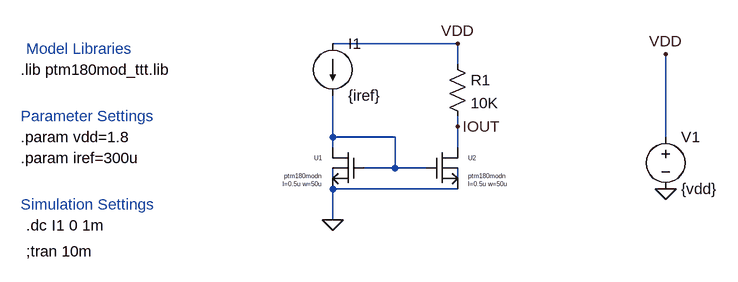
[diagram p0: schematic current_mirror.asc]
current_mirror.asc, the LTspice schematic file:
Version 4
SHEET 1 880 736
WIRE 0 400 -192 400
WIRE 0 432 0 400
WIRE 0 528 0 512
WIRE -192 544 -192 480
WIRE -96 544 -192 544
WIRE 320 544 320 416
WIRE -192 560 -192 544
WIRE 0 560 0 528
WIRE -96 592 -96 544
WIRE -96 592 -144 592
WIRE -48 592 -96 592
WIRE -192 608 -192 592
WIRE 0 608 0 592
WIRE 0 624 -192 624
WIRE -192 672 -192 624
FLAG -192 672 0
FLAG 0 400 VDD
FLAG 320 416 VDD
FLAG 320 624 0
FLAG 0 528 IOUT
SYMBOL voltage 320 528 R0
SYMATTR InstName V1
SYMATTR Value {vdd}
SYMBOL current -192 400 R0
SYMATTR InstName I1
SYMATTR Value {iref}
SYMBOL cnm25mod_nmos4 -144 560 M0
SYMATTR SpiceModel ptm180modn
SYMATTR InstName U1
SYMATTR Value l=0.5u w=50u
SYMBOL cnm25mod_nmos4 -48 560 R0
SYMATTR SpiceModel ptm180modn
SYMATTR InstName U2
SYMATTR Value l=0.5u w=50u
SYMBOL res -16 416 R0
SYMATTR InstName R1
SYMATTR Value 10K
TEXT -664 720 Left 2 !;tran 10m
TEXT -672 512 Left 2 ;Parameter Settings
TEXT -672 648 Left 2 ;Simulation Settings
TEXT -672 440 Left 2 !.lib ptm180mod_ttt.lib
TEXT -664 408 Left 2 ;Model Libraries
TEXT -664 680 Left 2 !.dc I1 0 1m
TEXT -672 576 Left 2 !.param iref=300u
TEXT -672 544 Left 2 !.param vdd=1.8

The netlist it stands for:
* current_mirror.asc
V1 VDD 0 {vdd}
I1 VDD N001 {iref}
XU1 N001 N001 0 N002 ptm180modn l=0.5u w=50u  ; pins D G S B
XU2 IOUT N001 0 N003 ptm180modn l=0.5u w=50u  ; pins D G S B
R1 VDD IOUT 10K
;tran 10m
* Parameter Settings
* Simulation Settings
.lib ptm180mod_ttt.lib
* Model Libraries
.dc I1 0 1m
.param iref=300u
.param vdd=1.8
.backanno
.end